# Altium project 36V E-Bike Reference Design.PrjPCB (part 4 of 4)
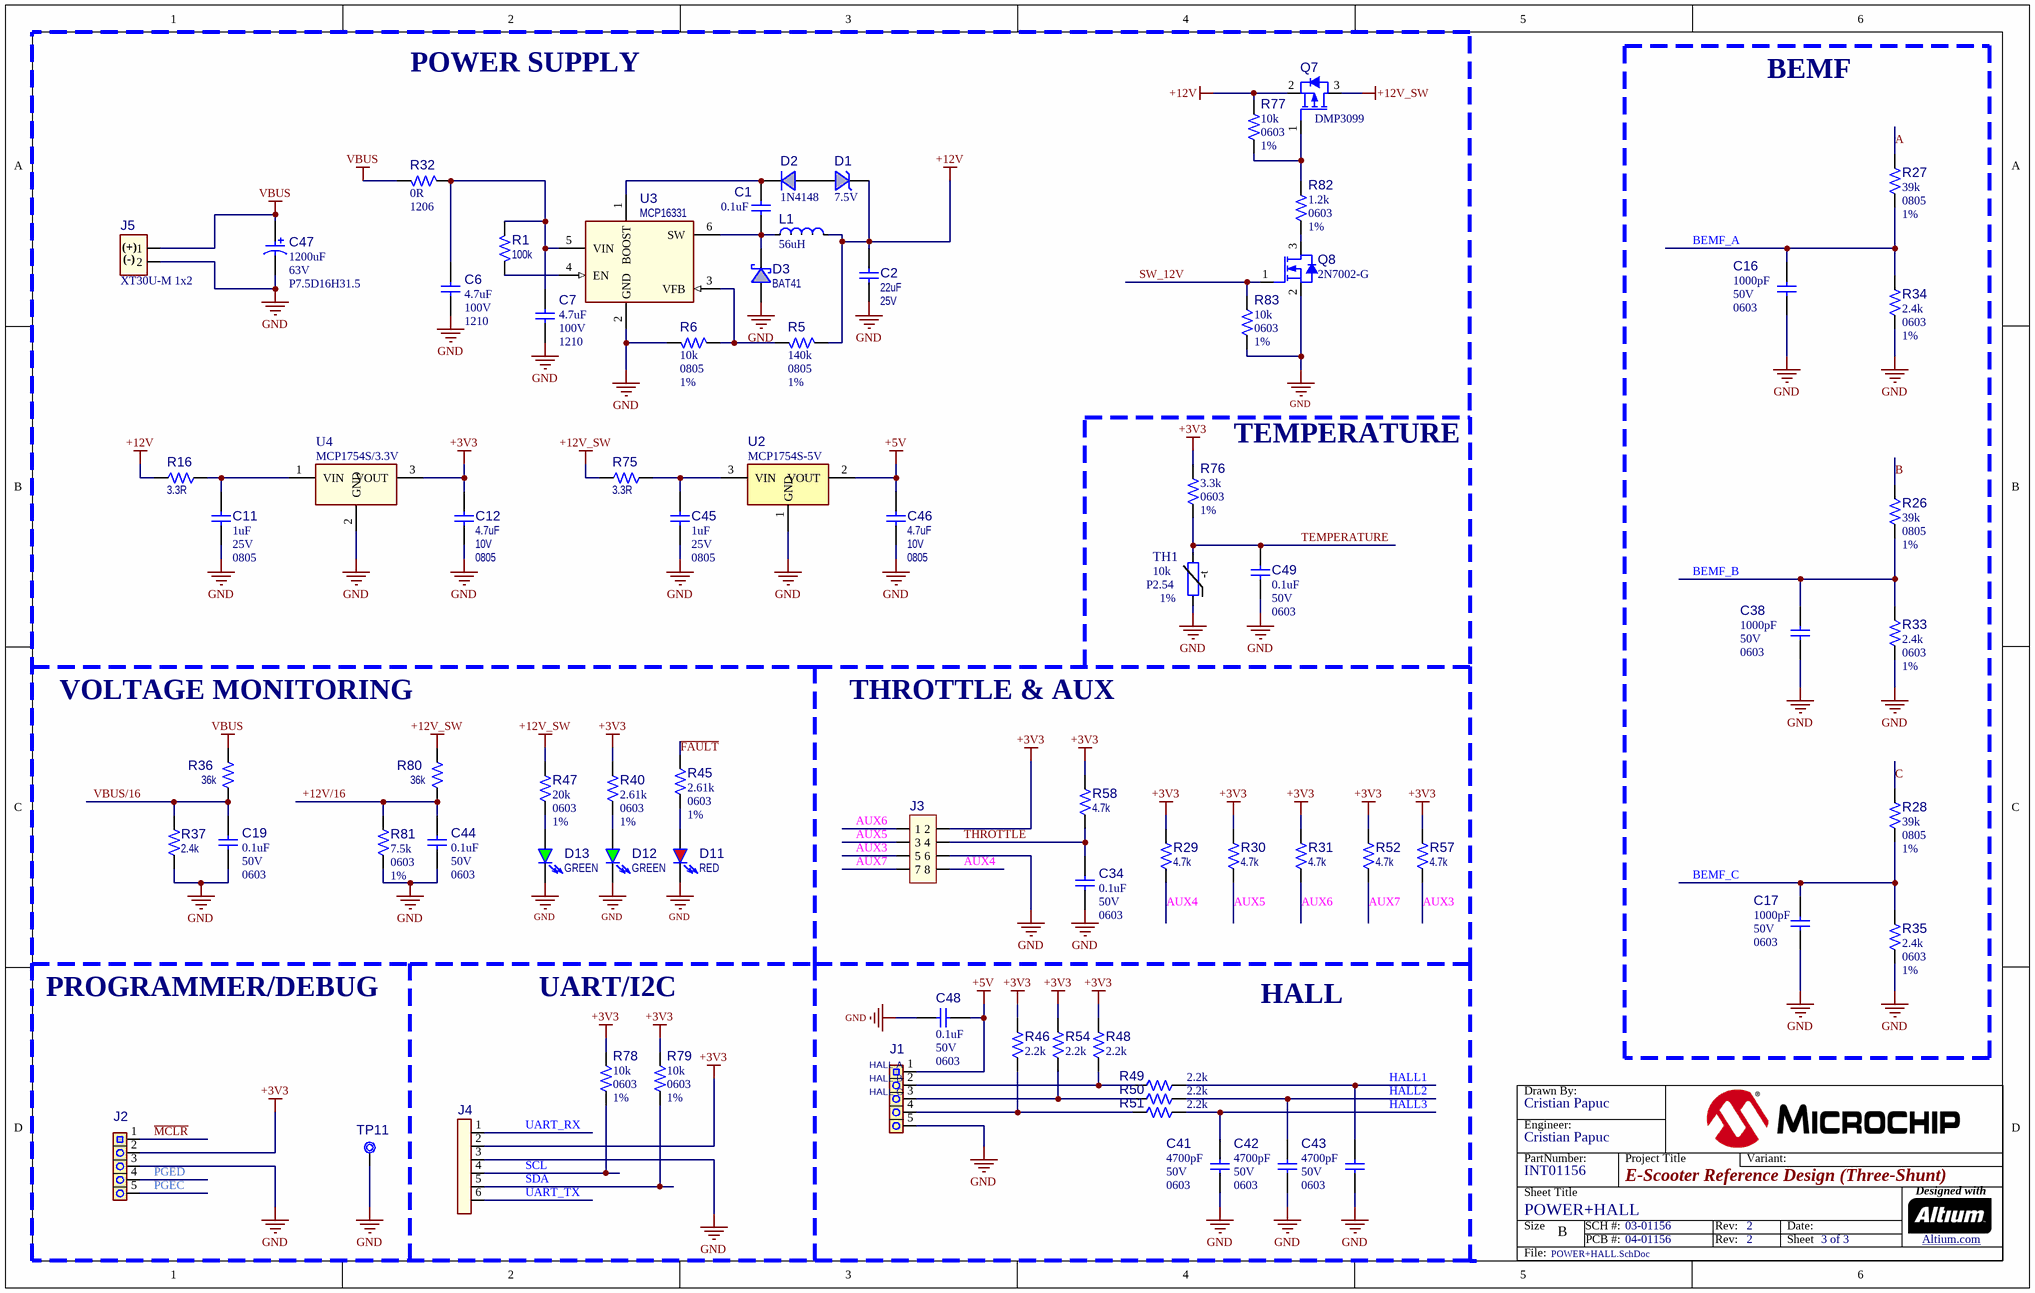
[diagram p4: POWER+HALL.SchDoc]

## Sheet POWER+HALL.SchDoc (continued)

### Library data of the parts (continued)
R82 = RSMT1022: Manufacturer 1: Stackpole Electronics Inc; Manufacturer Part Number 1: RMCF0603FT1K20; Description_: RES TKF 1.2k 1% 1/10W SMD 0603; Dev Tools Status: Production; Voltage: 50V; Temperature Coeffcient: 100ppm/C; Current: 1A; Power: 1/10W; Owner: Aaron VanDuerm; Populated: Yes; MCHP-ID: RSMT1022; Revision: 1; Symbol: Resistor; Status: MCL Design; ComponentLink1URL: https://chn-vm-apps.microchip.com/mchprepo/parts/Datasheets/SEI-RMCF_RMCP.pdf; ComponentLink1Description: SVN Datasheet; ComponentLink2URL: C:\ALTIUM_WORK\00001_MCHP-CDB\Datasheets\SEI-RMCF_RMCP.pdf; ComponentLink2Description: Local Datasheet; ComponentLink3URL: C:\ALTIUM_WORK\00001_MCHP-CDB\Library\LibraryRefs\Resistor.SchLib; ComponentLink3Description: Open Symbol; ComponentLink4URL: C:\ALTIUM_WORK\00001_MCHP-CDB\Library\Footprints\RES_C_0603.PcbLib; ComponentLink4Description: Open Footprint; ComponentLink5Description: Open Footprint 2; ComponentLink6Description: Open Footprint 3; ComponentLink7Description: Open Footprint 4; Operating Temperature: -55C to +155C; Category: Resistor; Type: RES SMD; Composition: TKF; Supplier 1: Digi-Key; Supplier Part Number 1: RMCF0603FT1K20CT-ND; Quantity Override: 1
TH1 = RES2734: Manufacturer 1: EPCOS - TDK Electronics; Manufacturer Part Number 1: B57861S0103F040; Description_: RES THERMISTOR NTC RADIAL 10k TH P2.54mm 3988K BEAD; Dev Tools Status: Design; Power: 60mW; Owner: Octavian Stroe; Populated: YES; MCHP-ID: RES2734; Revision: 2; Symbol: Thermistor NTC; Status: MCL Design; ComponentLink1URL: https://chn-vm-apps.microchip.com/mchprepo/parts/Datasheets/NTC_Mini_sensors_S861.pdf; ComponentLink1Description: SVN Datasheet; ComponentLink2URL: C:\ALTIUM_WORK\00001_MCHP-CDB\Datasheets\NTC_Mini_sensors_S861.pdf; ComponentLink2Description: Local Datasheet; ComponentLink3URL: C:\ALTIUM_WORK\00001_MCHP-CDB\Library\LibraryRefs\Thermistor NTC.SchLib; ComponentLink3Description: Open Symbol; ComponentLink4URL: C:\ALTIUM_WORK\00001_MCHP-CDB\Library\Footprints\Thermistor_Wired_P2.54.PcbLib; ComponentLink4Description: Open Footprint; ComponentLink5Description: Open Footprint 2; ComponentLink6Description: Open Footprint 3; ComponentLink7Description: Open Footprint 4; Operating Temperature: -55C to +155C; Category: Resistor; Type: Thermistor; Supplier 1: Digi-Key; Supplier Part Number 1: 495-2142-ND; Quantity Override: 1; ComponentLink7URL: C:\ALTIUM_WORK\00001_MCHP-CDB\Library\Footprints\Thermistor_Wired_P1.5.PcbLib
TP11 = CON1747: Test Point; Description_: CON TP PAD PCB 3.4x5 SMD; Dev Tools Status: Design; Owner: Gabor Bihari; Populated: YES; MCHP-ID: CON1747; Revision: A; Symbol: Test Point No BOM; Status: MCL Design; ComponentLink1Description: SVN Datasheet; ComponentLink2Description: Local Datasheet; ComponentLink3URL: C:\ALTIUM_WORK\00001_MCHP-CDB\Library\LibraryRefs\Test Point No BOM.SchLib; ComponentLink3Description: Open Symbol; ComponentLink4URL: C:\ALTIUM_WORK\00001_MCHP-CDB\Library\Footprints\TP_3.4x5_SMD_NOBOM.PcbLib; ComponentLink4Description: Open Footprint; ComponentLink5Description: Open Footprint 2; ComponentLink6Description: Open Footprint 3; ComponentLink7Description: Open Footprint 4; Type: Test Point; Category: Connector; Quantity Override: 1
U2 = MIC9094: LDO; Manufacturer 1: Microchip Technology Inc; Manufacturer Part Number 1: MCP1754S-5002E/CB; Description_: MCHP ANALOG LDO 5V MCP1754S-5002E/CB SOT-23A-3; Dev Tools Status: Design; Owner: Octavian Stroe; Populated: YES; MCHP-ID: MIC9094; Symbol: MCP1754ST-5002ECB SOT-23A-3; Type: LDO; Status: MCL Design; Revision: 1; Category: MCHP-Analog; ComponentLink1Description: SVN Datasheet; ComponentLink2Description: Local Datasheet; ComponentLink3URL: C:\ALTIUM_WORK\00001_MCHP-CDB\Library\LibraryRefs\MCP1754ST-5002ECB SOT-23A-3.SchLib; ComponentLink3Description: Open Symbol; ComponentLink4URL: C:\ALTIUM_WORK\00001_MCHP-CDB\Library\Footprints\SOT-23A-3.PcbLib; ComponentLink4Description: Open Footprint; ComponentLink5Description: Open Footprint 2; ComponentLink6Description: Open Footprint 3; ComponentLink7Description: Open Footprint 4; Supplier 1: Microchip Technology Inc; Supplier Part Number 1: MCP1754S-5002E/CB; Quantity Override: 1
U3 = MIC6150: DC-DC Convertor; Manufacturer 1: Microchip Technology; Manufacturer Part Number 1: MCP16331T-E/CH; Description_: MCHP ANALOG SWITCHER Buck 2 to 24V MCP16331T-E/CH SOT-23-6; Dev Tools Status: Production; Owner: Bogdan Popescu; Populated: YES; MCHP-ID: MIC6150; Symbol: MCP16331 SOT-23-6; Type: Switcher; Status: MCL Design; Revision: 1; Category: MCHP-Analog; ComponentLink1Description: SVN Datasheet; ComponentLink2Description: Local Datasheet; ComponentLink3URL: C:\ALTIUM_WORK\00001_MCHP-CDB\Library\LibraryRefs\MCP16331 SOT-23-6.SchLib; ComponentLink3Description: Open Symbol; ComponentLink4URL: C:\ALTIUM_WORK\00001_MCHP-CDB\Library\Footprints\SOT-23-6.PcbLib; ComponentLink4Description: Open Footprint; ComponentLink5Description: Open Footprint 2; ComponentLink6Description: Open Footprint 3; ComponentLink7Description: Open Footprint 4; Supplier 1: Microchip Technology; Supplier Part Number 1: MCP16331T-E/CH; Quantity Override: 1
U4 = MIC5958: LDO; Manufacturer 1: Microchip; Manufacturer Part Number 1: MCP1754ST-3302E/DB; Description_: MCHP ANALOG LDO 3.3V MCP1754ST-3302E/DB SOT-223-3; MAPS Description: 16V, High PSRR, 150mA LDO, Vout=3.3V; Dev Tools Status: Production; Owner: Tad Ahlvers; MPC: V0AB2YF6XB00; LeadContent: Pb-FREE; PackingMedia: T/R; Stage: REL; LeadCount: 3; ForceMinOrderQtyMult: True; MinOrderQty: 1; TempRange: -40C to +125C; tblDeviceFamilyID: 3163; Populated: YES; MCHP-ID: MIC5958; Symbol: MCP1754S SOT-89-3_SOT-223-3; Type: LDO; Status: MCL Design; Revision: 1; Category: MCHP-Analog; ComponentLink1URL: http://www.microchip.com/wwwproducts/MCP1754S; ComponentLink1Description: SVN Datasheet; ComponentLink2Description: Local Datasheet; ComponentLink3URL: C:\ALTIUM_WORK\00001_MCHP-CDB\Library\LibraryRefs\MCP1754S SOT-89-3_SOT-223-3.SchLib; ComponentLink3Description: Open Symbol; ComponentLink4URL: C:\ALTIUM_WORK\00001_MCHP-CDB\Library\Footprints\SOT-223-3.PcbLib; ComponentLink4Description: Open Footprint; ComponentLink5Description: Open Footprint 2; ComponentLink6Description: Open Footprint 3; ComponentLink7Description: Open Footprint 4; Supplier 1: Microchip; Supplier Part Number 1: MCP1754ST-3302E/DB; IntroductionDate: 2011-08-16; PackageType: SOT-223; Quantity Override: 1

## Nets that join several sheets
+3V3: dsPIC33CK (12 pins), POWER+HALL (18 pins)
+12V_SW: INVERTER (6 pins), POWER+HALL (Q7.3 R47.2 R75.1 R80.2)
GND: dsPIC33CK (15 pins), INVERTER (12 pins), POWER+HALL (41 pins)
VBUS: INVERTER (6 pins), POWER+HALL (C47.1 J5.1 R32.2 R36.2)
+12V/16: dsPIC33CK (U1.35), POWER+HALL (C44.2 R80.1 R81.2)
~{FAULT}: dsPIC33CK (TP1.1 U1.24), POWER+HALL (R45.2)
~{MCLR}: dsPIC33CK (R44.1 U1.5), POWER+HALL (J2.1)
A: INVERTER (8 pins), POWER+HALL (R27.2)
AUX3: dsPIC33CK (U1.3), POWER+HALL (J3.5 R57.1)
AUX4: dsPIC33CK (U1.4), POWER+HALL (J3.8 R29.1)
AUX5: dsPIC33CK (U1.44), POWER+HALL (J3.3 R30.1)
AUX6: dsPIC33CK (U1.30), POWER+HALL (J3.1 R31.1)
AUX7: dsPIC33CK (U1.6), POWER+HALL (J3.7 R52.1)
B: INVERTER (8 pins), POWER+HALL (R26.2)
BEMF_A: dsPIC33CK (U1.21), POWER+HALL (C16.2 R27.1 R34.2)
BEMF_B: dsPIC33CK (U1.22), POWER+HALL (C38.2 R26.1 R33.2)
BEMF_C: dsPIC33CK (U1.23), POWER+HALL (C17.2 R28.1 R35.2)
C: INVERTER (8 pins), POWER+HALL (R28.2)
CS1_N: dsPIC33CK (R53.2), INVERTER (R62.3)
CS1_P: dsPIC33CK (R42.2), INVERTER (R62.4)
CS2_N: dsPIC33CK (R72.2), INVERTER (R61.3)
CS2_P: dsPIC33CK (R74.2), INVERTER (R61.4)
CS3_N: dsPIC33CK (R66.2), INVERTER (R60.3)
CS3_P: dsPIC33CK (R68.2), INVERTER (R60.4)
HALL1: dsPIC33CK (U1.38), POWER+HALL (C43.2 R49.2)
HALL2: dsPIC33CK (U1.39), POWER+HALL (C42.2 R50.2)
HALL3: dsPIC33CK (U1.40), POWER+HALL (C41.2 R51.2)
PGEC: dsPIC33CK (U1.34), POWER+HALL (J2.5)
PGED: dsPIC33CK (U1.33), POWER+HALL (J2.4)
PWM1H: dsPIC33CK (U1.1), INVERTER (PWM1H.1 U7.5)
PWM1L: dsPIC33CK (U1.2), INVERTER (PWM1L.1 U7.6)
PWM2H: dsPIC33CK (U1.47), INVERTER (PWM2H.1 U6.5)
PWM2L: dsPIC33CK (U1.48), INVERTER (PWM2L.1 U6.6)
PWM3H: dsPIC33CK (U1.45), INVERTER (PWM3H.1 U5.5)
PWM3L: dsPIC33CK (U1.46), INVERTER (PWM3L.1 U5.6)
SCL: dsPIC33CK (U1.36), POWER+HALL (J4.4 R78.1)
SDA: dsPIC33CK (U1.37), POWER+HALL (J4.5 R79.1)
SW_12V: dsPIC33CK (U1.41), POWER+HALL (Q8.1 R83.2)
TEMPERATURE: dsPIC33CK (U1.7), POWER+HALL (C49.1 R76.1 TH1.2)
THROTTLE: dsPIC33CK (U1.17), POWER+HALL (C34.2 J3.4 R58.1)
UART_RX: dsPIC33CK (U1.29), POWER+HALL (J4.1)
UART_TX: dsPIC33CK (U1.28), POWER+HALL (J4.6)
VBUS/16: dsPIC33CK (U1.20), POWER+HALL (C19.2 R36.1 R37.2)

## Assembly variants
Standard: not fitted R58